# Altium schematic sheet CurrentSense_isoSPI_Interface.SchDoc: Current Sense isoSPI Interface
size Letter; Author: Taiping Li; Revision: 2.1; Website: www.uwmidsun.com; ProjectAuthor: Taiping Li
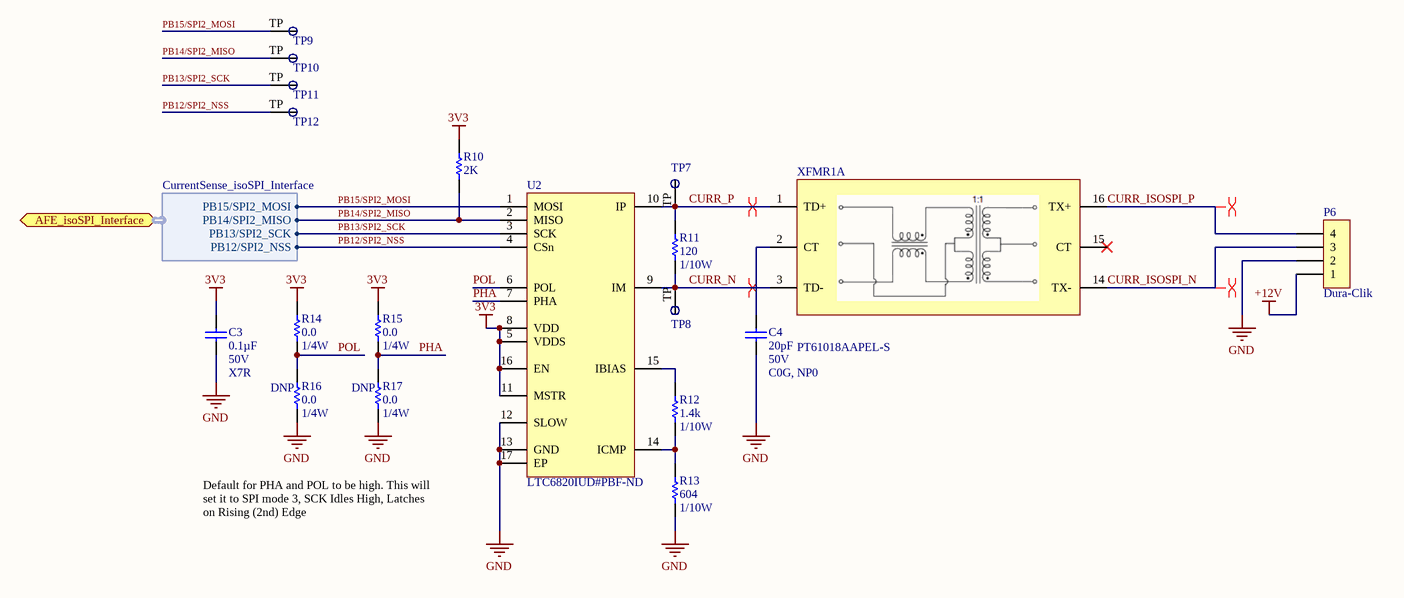
[diagram p0: CurrentSense_isoSPI_Interface.SchDoc]

## Parts
C3  Capacitance: 0.1µF  Voltage: 50V  Temperature Coefficient: X7R  [CAP, 0603]  (hidden comment: CAP CER 0.1UF 50V 10% X7R 0603)
C4  Capacitance: 20pF  Voltage: 50V  Temperature Coefficient: C0G, NP0  [CAP, 0603]  (hidden comment: CAP CER 20PF 50V ±5% C0G/NP0 0603)
P6  Dura-Clik  [CONN, 4POS DURA-CLIK VERT]
R10  2K  [RES, 0603]
R11  Resistance: 120  Power: 1/10W  [RES, 0603]  (hidden comment: RES 120 OHM 1% 1/10W 0603)
R12  Resistance: 1.4k  Power: 1/10W  [RES, 0603]  (hidden comment: RES 1.4k OHM 1% 1/10W 0603)
R13  Resistance: 604  Power: 1/10W  [RES, 0603]  (hidden comment: RES 604 OHM 1% 1/10W 0603)
R14  Resistance: 0.0  Power (Watts): 1/4W  [RES, 0603]  (hidden comment: RES 0.0 OHM 1/4W 0603)
R15  Resistance: 0.0  Power (Watts): 1/4W  [RES, 0603]  (hidden comment: RES 0.0 OHM 1/4W 0603)
R16  Resistance: 0.0  Power (Watts): 1/4W  [RES, 0603]  (hidden comment: RES 0.0 OHM 1/4W 0603)  (no BOM)
R17  Resistance: 0.0  Power (Watts): 1/4W  [RES, 0603]  (hidden comment: RES 0.0 OHM 1/4W 0603)  (no BOM)
TP7  Test Point  [Test Point]  (value not drawn)
TP8  Test Point  [Test Point]  (value not drawn)
TP9  Test Point  [Test Point]  (value not drawn)
TP10  Test Point  [Test Point]  (value not drawn)
TP11  Test Point  [Test Point]  (value not drawn)
TP12  Test Point  [Test Point]  (value not drawn)
U2  Supplier Part Number 1: LTC6820IUD#PBF-ND  [IC COMM INTERFACE ISOSPI 16-QFN]  (hidden comment: IC ISOSPI COMM INTERFACE LTC6820IUD)
XFMR1  MFG_PN: PT61018AAPEL-S  [IC, PULSE XFMR 1CT:1CT 350UH SMD]  (hidden comment: IC PULSE XFMR 1CT:1CT 350UH SMD)  (part A of 2)

## Ports
AFE_isoSPI_Interface (harness CurrentSense_isoSPI_Interface)

## Harnesses
CurrentSense_isoSPI_Interface: PB15/SPI2_MOSI, PB14/SPI2_MISO, PB13/SPI2_SCK, PB12/SPI2_NSS

## Nets
3V3: C3.1 R10.1 R14.1 R15.1 U2.5(VDDS) U2.8(VDD) U2.11(MSTR) U2.16(EN)
+12V: P6.1
GND: C3.2 C4.2 P6.2 R13.2 R16.2 R17.2 U2.12(SLOW) U2.13(GND) U2.17(EP)
CURR_ISOSPI_N: P6.3 XFMR1.14(TX-)
CURR_ISOSPI_P: P6.4 XFMR1.16(TX+)
CURR_N: R11.2 TP8.TP U2.9(IM) XFMR1.3(TD-)
CURR_P: R11.1 TP7.TP U2.10(IP) XFMR1.1(TD+)
PB12/SPI2_NSS: TP12.TP U2.4(CSn) ; port AFE_isoSPI_Interface.PB12/SPI2_NSS
PB13/SPI2_SCK: TP11.TP U2.3(SCK) ; port AFE_isoSPI_Interface.PB13/SPI2_SCK
PB14/SPI2_MISO: R10.2 TP10.TP U2.2(MISO) ; port AFE_isoSPI_Interface.PB14/SPI2_MISO
PB15/SPI2_MOSI: TP9.TP U2.1(MOSI) ; port AFE_isoSPI_Interface.PB15/SPI2_MOSI
PHA: R15.2 R17.1 U2.7(PHA)
POL: R14.2 R16.1 U2.6(POL)
NetC4_1: C4.1 XFMR1.2(CT)
NetR12_1: R12.1 U2.15(IBIAS)
NetR12_2: R12.2 R13.1 U2.14(ICMP)

Not connected (* = marked no-connect by the designer): XFMR1 15(CT)*

## Layout directives
differential pair: CURR_ISOSPI_N, CURR_ISOSPI_P, CURR_N, CURR_P

## Notes on the sheet
- Default for PHA and POL to be high. This will set it to SPI mode 3, SCK Idles High, Latches on Rising (2nd) Edge
- Project:
- Title:
- Size:
- Project Lead:
- Letter
- Revision:
- University of Waterloo
- 200 University Ave W
- Waterloo, ON, Canada
- N2L 3E9
- Date:
- Sheet
- of
- Website:

## Library data of the parts
C3 = CAP CER 0.1UF 50V 10% X7R 0603: 0.10µF ±10% 50V Ceramic Capacitor X7R 0603 (1608 Metric); Manufacturer 1: AVX Corporation; Manufacturer Part Number 1: 06035C104KAT2A; Supplier 1: Digi-Key; Supplier Part Number 1: 478-5052-1-ND; Packaging: Cut Tape (CT); Part Status: Active; Operating Temperature: -55°C ~ 125°C; Ratings: -; Mounting Type: Surface Mount, MLCC; Package / Case: 0603 (1608 Metric); Size / Dimension: 0.063" L x 0.032" W (1.60mm x 0.81mm); Height - Seated (Max): -; Thickness (Max): 0.035" (0.90mm); Lead Spacing: -; Lead Style: -; ComponentLink1URL: http://datasheets.avx.com/X7RDielectric.pdf; ComponentLink1Description: http://datasheets.avx.com/X7RDielectric.pdf; Tolerance: ±10%
C4 = CAP CER 20PF 50V ±5% C0G/NP0 0603: 20pF ±5% 50V Ceramic Capacitor C0G, NP0 0603 (1608 Metric); Manufacturer 1: Murata Electronics North America; Manufacturer Part Number 1: GRM1885C1H200JA01D; Supplier 1: Digi-Key; Supplier Part Number 1: 490-1410-1-ND; Packaging: Cut Tape (CT); Part Status: Active; Operating Temperature: -55°C ~ 125°C; Ratings: -; Mounting Type: Surface Mount, MLCC; Package / Case: 0603 (1608 Metric); Size / Dimension: 0.063" L x 0.031" W (1.60mm x 0.80mm); Height - Seated (Max): -; Thickness (Max): 0.035" (0.90mm); Lead Spacing: -; Lead Style: -; ComponentLink1URL: http://www.murata.com/~/media/webrenewal/support/library/catalog/products/capacitor/mlcc/c02e.ashx; ComponentLink1Description: http://www.murata.com/~/media/webrenewal/support/library/catalog/products/capacitor/mlcc/c02e.ashx; Tolerance: ±5%
P6 = CONN 4POS DURA-CLIK 0.079": 4 Positions Header Connector 0.079" (2.00mm) Surface Mount Tin; Manufacturer: Molex, LLC; Manufacturer Part Number: 5600200420; Style: Board to Cable/Wire; Shrouding: Shrouded - 4 Wall; Number of Positions: 4; Number of Positions Loaded: All; Mated Stacking Heights: 9.3mm; Supplier 1: Digi-Key; RoHS: RoHS Compliant; Category: Connectors, Interconnects; Stock 1: 9367; Pricing 1: 1=2.23, 10=2.022, 25=1.898, 50=1.8156, 100=1.733 (CAD); Packaging: Cut Tape (CT); Part Status: Active; Connector Type: Header; Contact Type: Male Pin; Pitch - Mating: 0.079" (2.00mm); Number of Rows: 1; Row Spacing - Mating: -; Mounting Type: Surface Mount; Termination: Solder; Fastening Type: Latch Lock; Contact Length - Mating: -; Contact Length - Post: -; Overall Contact Length: -; Insulation Height: 0.315" (8.00mm); Contact Shape: Square; Contact Finish - Mating: Tin; Contact Finish Thickness - Mating: -; Contact Finish - Post: Tin; Contact Material: Copper Alloy; Insulation Material: Polyamide (PA), Nylon; Features: Solder Retention; Operating Temperature: -; Ingress Protection: -; Material Flammability Rating: -; Insulation Color: Natural; Current Rating: -; Voltage Rating: -; Contact Finish Thickness - Post: -; Applications: Automotive, Industrial; ComponentLink1URL: http://www.molex.com/pdm_docs/sd/5600200420_sd.pdf; ComponentLink1Description: http://www.molex.com/pdm_docs/sd/5600200420_sd.pdf; Supplier Part Number 1: WM10864CT-ND
R10 = RES 2K OHM 1% 1/10W 0603: 2k Ohm ±1% 0.1W, 1/10W Chip Resistor 0603 (1608 Metric) Moisture Resistant Thick Film; Manufacturer: Yageo; Manufacturer Part Number: RC0603FR-072KL; Temperature Coefficient: ±100ppm/°C; Supplier 1: Digi-Key; RoHS: RoHS Compliant; Category: Resistors; Stock 1: 1750701; Pricing 1: 1=0.15, 10=0.023, 100=0.0093, 1000=0.00415, 2500=0.0036 (CAD); Packaging: Cut Tape (CT); Part Status: Active; Resistance (Ohms): 2k; Tolerance: ±1%; Power (Watts): 0.1W, 1/10W; Composition: Thick Film; Features: Moisture Resistant; Operating Temperature: -55°C ~ 155°C; Package / Case: 0603 (1608 Metric); Supplier Device Package: 0603; Size / Dimension: 0.063" L x 0.031" W (1.60mm x 0.80mm); Height - Seated (Max): 0.022" (0.55mm); Failure Rate: -; ComponentLink1URL: http://www.yageo.com/documents/recent/PYu-RC_Group_51_RoHS_L_7.pdf; ComponentLink1Description: http://www.yageo.com/documents/recent/PYu-RC_Group_51_RoHS_L_7.pdf; Supplier Part Number 1: 311-2.00KHRCT-ND
R11 = RES 120 OHM 1% 1/10W 0603: RES SMD 120 OHM 1% 1/10W 0603; Manufacturer 1: Yageo; Manufacturer Part Number 1: RC0603FR-07120RL; Temperature Coefficient: ±100ppm/°C; Supplier 1: Digi-Key; Supplier Part Number 1: 311-120HRCT-ND; Packaging: Cut Tape (CT); Part Status: Active; Composition: Thick Film; Operating Temperature: -55°C ~ 155°C; Package / Case: 0603 (1608 Metric); Supplier Device Package: 0603; Size / Dimension: 0.063" L x 0.031" W (1.60mm x 0.80mm); Height - Seated (Max): 0.022" (0.55mm); Failure Rate: -; ComponentLink1URL: http://www.yageo.com/documents/recent/PYu-RC_Group_51_RoHS_L_7.pdf; ComponentLink1Description: http://www.yageo.com/documents/recent/PYu-RC_Group_51_RoHS_L_7.pdf; Tolerance: ±1%
R12 = RES 1.4k OHM 1% 1/10W 0603: RES SMD 1.4K OHM 1% 1/10W 0603; Manufacturer 1: Yageo; Manufacturer Part Number 1: RC0603FR-071K4L; Temperature Coefficient: ±100ppm/°C; Supplier 1: Digi-Key; Supplier Part Number 1: 311-1.40KHRCT-ND; Packaging: Cut Tape (CT); Part Status: Active; Composition: Thick Film; Operating Temperature: -55°C ~ 155°C; Package / Case: 0603 (1608 Metric); Supplier Device Package: 0603; Size / Dimension: 0.063" L x 0.031" W (1.60mm x 0.80mm); Height - Seated (Max): 0.022" (0.55mm); Failure Rate: -; ComponentLink1URL: http://www.yageo.com/documents/recent/PYu-RC_Group_51_RoHS_L_7.pdf; ComponentLink1Description: http://www.yageo.com/documents/recent/PYu-RC_Group_51_RoHS_L_7.pdf; Tolerance: ±1%
R13 = RES 604 OHM 1% 1/10W 0603: RES SMD 604 OHM 1% 1/10W 0603; Manufacturer 1: Yageo; Manufacturer Part Number 1: RC0603FR-07604RL; Temperature Coefficient: ±100ppm/°C; Supplier 1: Digi-Key; Supplier Part Number 1: 311-604HRCT-ND; Packaging: Cut Tape (CT); Part Status: Active; Composition: Thick Film; Operating Temperature: -55°C ~ 155°C; Package / Case: 0603 (1608 Metric); Supplier Device Package: 0603; Size / Dimension: 0.063" L x 0.031" W (1.60mm x 0.80mm); Height - Seated (Max): 0.022" (0.55mm); Failure Rate: -; ComponentLink1URL: http://www.yageo.com/documents/recent/PYu-RC_Group_51_RoHS_L_7.pdf; ComponentLink1Description: http://www.yageo.com/documents/recent/PYu-RC_Group_51_RoHS_L_7.pdf; Tolerance: ±1%
R14-R17 = RES 0.0 OHM 1/4W 0603: RES SMD 0.0 OHM JUMPER 1/4W 0603; Manufacturer 1: Vishay Dale; Manufacturer Part Number 1: CRCW06030000Z0EAHP; Supplier 1: Digi-Key; Supplier Part Number 1: 541-0.0SBCT-ND; Packaging: Cut Tape (CT); Part Status: Active; Composition: Thick Film; Operating Temperature: -55°C ~ 155°C; Package / Case: 0603 (1608 Metric); Supplier Device Package: 0603; Size / Dimension: 0.063" L x 0.033" W (1.60mm x 0.85mm); Height - Seated (Max): 0.022" (0.55mm); Failure Rate: -; ComponentLink1URL: http://www.vishay.com/docs/20043/crcwhpe3.pdf; ComponentLink1Description: http://www.vishay.com/docs/20043/crcwhpe3.pdf
  R16 R17: DNP: DNP
U2 = IC ISOSPI COMM INTERFACE LTC6820IUD: IC COMM INTERFACE ISOSPI 16-QFN; Manufacturer: Linear Technology; Manufacturer Part Number: LTC6820IUD#PBF; Interface: SPI; Voltage - Supply: 2.7 V ~ 5.5 V; Supplier 1: Digi-Key; RoHS: RoHS Compliant; Category: Integrated Circuits (ICs); Stock 1: 827; Pricing 1: 1=7.35, 25=4.8816, 100=4.0066 (CAD); Packaging: Tube; Part Status: Active; Applications: Isolated Communications Interface; Package / Case: 16-WFQFN Exposed Pad; Supplier Device Package: 16-QFN (3x3); Mounting Type: Surface Mount; ComponentLink1URL: http://www.linear.com/docs/42317; ComponentLink1Description: http://www.linear.com/docs/42317
XFMR1 = IC PULSE XFMR 1CT:1CT 350UH SMD: PULSE XFMR 1CT:1CT 350UH SMD; Manufacturer: Bourns Inc.; Isolation Voltage: 1.5kVrms; Supplier: Digikey; Supplier_PN: PT61018AAPEL-SCT-ND; Inductance: 350uH; Supplier 1: Digi-Key; Supplier Part Number 1: PT61018AAPEL-SCT-ND